# Altium schematic sheet USB2BT2.SchDoc
size A4
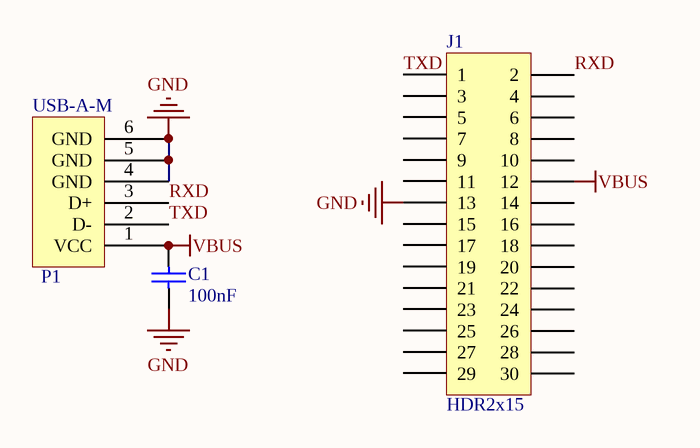
[diagram p0: USB2BT2.SchDoc]

## Parts
C1  100nF  [0603C]
J1  HDR2x15  [HC-05/06/08V15]
P1  USB-A-M  [USB-A-M]

## Nets
GND: C1.1 J1.13 P1.4(GND) P1.5(GND) P1.6(GND)
VBUS: C1.2 J1.12 P1.1(VCC)
RXD: J1.2 P1.3(D+)
TXD: J1.1 P1.2(D-)

Not connected (* = marked no-connect by the designer): J1 3 4 5 6 7 8 9 10 11 14 15 16 17 18 19 20 21 22 23 24 25 26 27 28 29 30

## Library data of the parts
C1 = Cap: Capacitor; Published: 8-Jun-2000; LatestRevisionDate: 17-Jul-2002; LatestRevisionNote: Re-released for DXP Platform.; PackageReference: RAD-0.3; Publisher: Altium Limited; Value: 100nF
J1 = HDR2x15: Connector
P1 = USB-B